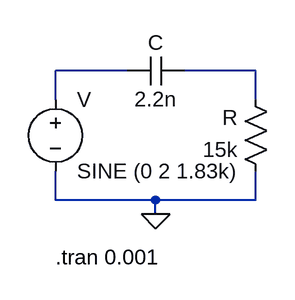
[diagram p0: schematic ερωτήματα 1-8.asc]
ερωτήματα 1-8.asc, the LTspice schematic file:
Version 4
SHEET 1 880 680
WIRE 144 80 64 80
WIRE 288 80 208 80
WIRE 64 112 64 80
WIRE 288 112 288 80
WIRE 64 224 64 192
WIRE 176 224 64 224
WIRE 288 224 288 192
WIRE 288 224 176 224
WIRE 176 240 176 224
FLAG 176 240 0
SYMBOL res 304 208 R180
WINDOW 0 36 76 Left 2
WINDOW 3 36 40 Left 2
SYMATTR InstName R
SYMATTR Value 15k
SYMBOL cap 208 64 R90
WINDOW 0 0 32 VBottom 2
WINDOW 3 32 32 VTop 2
SYMATTR InstName C
SYMATTR Value 2.2n
SYMBOL voltage 64 96 R0
SYMATTR InstName V
SYMATTR Value SINE (0 2 1.83k)
TEXT 64 288 Left 2 !.tran 0.001

The netlist it stands for:
* ερωτήματα 1-8.asc
R 0 N002 15k
C N002 N001 2.2n
V N001 0 SINE (0 2 1.83k)
.tran 0.001
.backanno
.end